# EAGLE design Qgo3 (EAGLE 6.5.0)
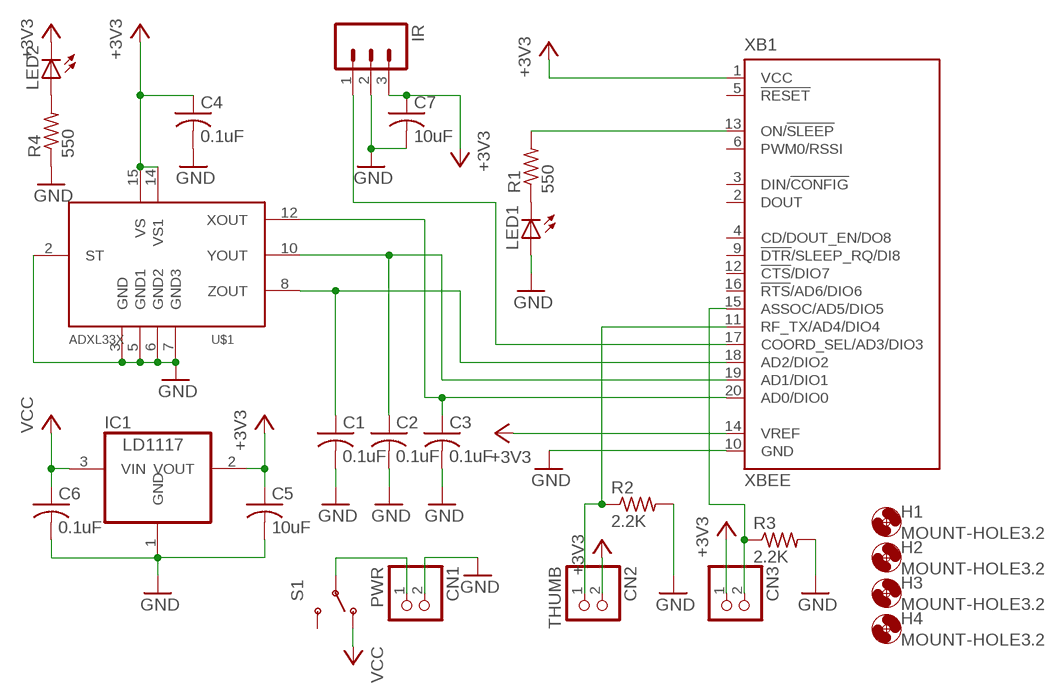
[diagram p0: schematic, sheet 1]

## Parts
C1  0.1uF  C-USC1210  [C1210]
C2  0.1uF  C-USC1210  [C1210]
C3  0.1uF  C-USC1210  [C1210]
C4  0.1uF  C-USC1210  [C1210]
C5  10uF  C-USC1210  [C1210]
C6  0.1uF  C-USC1210  [C1210]
C7  10uF  C-USC1210  [C1210]
CN1  PWR  JST_2PIN-THM-RA  [JST-PH-2-THM-RA]
CN2  THUMB  JST_2PIN-THM-RA  [JST-PH-2-THM-RA]
CN3  JST_2PIN-THM-RA  [JST-PH-2-THM-RA]
H1  MOUNT-HOLE3.2  [3,2]
H2  MOUNT-HOLE3.2  [3,2]
H3  MOUNT-HOLE3.2  [3,2]
H4  MOUNT-HOLE3.2  [3,2]
IC1  LD1117  [SOT223]
IR  M03PTH  [1X03]
LED1  LED5MM  [LED5MM]
LED2  LED5MM  [LED5MM]
R1  550  R-US_0207/7  [0207/7]
R2  2.2K  R-US_0207/7  [0207/7]
R3  2.2K  R-US_0207/7  [0207/7]
R4  550  R-US_0207/7  [0207/7]
S1  SWITCH-SPDTPTH  [SWITCH-SPDT]
U$1  ADXL33X  [16LCSP]
XB1  XBEE  [XBEE]

## Nets
+3V3: C4.1 C5.1 C7.1 CN2.2 CN3.1 IC1.2(VOUT) IR.3 LED2.K(C) U$1.14(VS1) U$1.15(VS) XB1.1(VCC) XB1.14(VREF)
GND: C1.2 C2.2 C3.2 C4.2 C5.2 C6.2 C7.2 CN1.2 IC1.1(GND) IR.2 LED1.A R2.2 R3.2 R4.1 U$1.2(ST) U$1.3(GND) U$1.5(GND1) U$1.6(GND2) U$1.7(GND3) XB1.10(GND)
N$1: C1.1 U$1.8(ZOUT) XB1.18(AD2/DIO2)
N$2: C2.1 U$1.10(YOUT) XB1.19(AD1/DIO1)
N$3: C3.1 U$1.12(XOUT) XB1.20(AD0/DIO0)
N$4: IR.1 XB1.17(COORD_SEL/AD3/DIO3)
N$5: CN1.1 S1.2(P)
N$6: LED1.K(C) R1.1
N$7: R1.2 XB1.13(ON/!SLEEP)
N$8: CN2.1 R2.1 XB1.11(RF_TX/AD4/DIO4)
N$9: LED2.A R4.2
N$11: CN3.2 R3.1 XB1.15(ASSOC/AD5/DIO5)
VCC: C6.1 IC1.3(VIN) S1.1(O)
Unconnected: S1.3(S) XB1.2(DOUT) XB1.3(DIN/!CONFIG) XB1.4(CD/DOUT_EN/DO8) XB1.5(!RESET) XB1.6(PWM0/RSSI) XB1.9(!DTR!/SLEEP_RQ/DI8) XB1.12(!CTS!/DIO7) XB1.16(!RTS!/AD6/DIO6)

## Library data of the parts
C1-C7 = resistor:C-US: CAPACITOR, American symbol
CN1-CN3 = adafruit:JST_2PIN: JST 2-Pin Connectors of various flavors SMT-RA (S2B-PH-SM4) 4UConnector #17311 SMT (B2B-PH-SM4) THM-RA (S2B-PH) THM (B2B-PH)
H1-H4 = holes:MOUNT-HOLE: MOUNTING HOLE with drill center marker
IC1 = myLibrary:LD1117: 800mA and 1A Low Dropout (LDO) Positive Regulator 1.8V, 2.5V, 2.85V, 3.3V, 5V, and Adj; MPN: REG1117; OC_FARNELL: 1097566; OC_NEWARK: 14P6981
IR = SparkFun-Connectors:M03: Header 3 Standard 3-pin 0.1" header. Use with straight break away headers (SKU : PRT-00116), right angle break away headers (PRT-00553), swiss pins (PRT-00743), machine pins (PRT-00117), and female headers (PRT-00115). Molex polarized connector foot print use with SKU : PRT-08232 with associated crimp pins and housings.
LED1 LED2 = adafruit:LED: LED OSRAM: - CHIPLED LG R971, LG N971, LY N971, LG Q971, LY Q971, LO R971, LY R971 LH N974, LH R974 LS Q976, LO Q976, LY Q976 LO Q996 - Hyper CHIPLED LW Q18S LB Q993, LB Q99A, LB R99A - SideLED LS A670, LO A670, LY A670, LG A670, LP A670 LB A673, LV A673, LT A673, LW A673 LH A674 LY A675 LS A676, LA A676, LO A676, LY A676, LW A676 LS A679, LY A679, LG A679 - Hyper Micro SIDELED® LS Y876, LA Y876, LO Y876, LY Y876 LT Y87S - SmartLED LW L88C, LW L88S LB L89C, LB L89S, LG L890 LS L89K, LO L89K, LY L89K LS L896, LA L896, LO L896, LY L896 - TOPLED LS T670, LO T670, LY T670, LG T670, LP T670 LSG T670, LSP T670, LSY T670, LOP T670, LYG T670 LG T671, LOG T671, LSG T671 LB T673, LV T673, LT T673, LW T673 LH T674 LS T676, LA T676, LO T676, LY T676, LB T676, LH T676, LSB T676, LW T676 LB T67C, LV T67C, LT T67C, LS T67K, LO T67K, LY T67K, LW E67C LS E67B, LA E67B, LO E67B, LY E67B, LB E67C, LV E67C, LT E67C LW T67C LS T679, LY T679, LG T679 LS T770, LO T770, LY T770, LG T770, LP T770 LB T773, LV T773, LT T773, LW T773 LH T774 LS E675, LA E675, LY E675, LS T675 LS T776, LA T776, LO T776, LY T776, LB T776 LHGB T686 LT T68C, LB T68C - Hyper Mini TOPLED® LB M676 - Mini TOPLED Santana® LG M470 LS M47K, LO M47K, LY M47K Source: http://www.osram.convergy.de/
R1 R4 = resistor:R-US_: RESISTOR, American symbol
R2 R3 = adafruit:R-US_: RESISTOR, American symbol
S1 = SparkFun-Electromechanical:SWITCH-SPDT: SPDT Switch Simple slide switch, Spark Fun Electronics SKU : COM-00102 DPDT SMT slide switch, AYZ0202, SWCH-08179
U$1 = adafruit:ADXL33X
XB1 = maxstream:XBEE: XBee (TM) /XBee-PRO(TM) OEM RF Modules Source: MaxStream, Inc. xbee_productmanual.pdf; MPN: XBP24-Z7UIT-004; OC_FARNELL: 1751799; OC_NEWARK: 34R5507

## Board
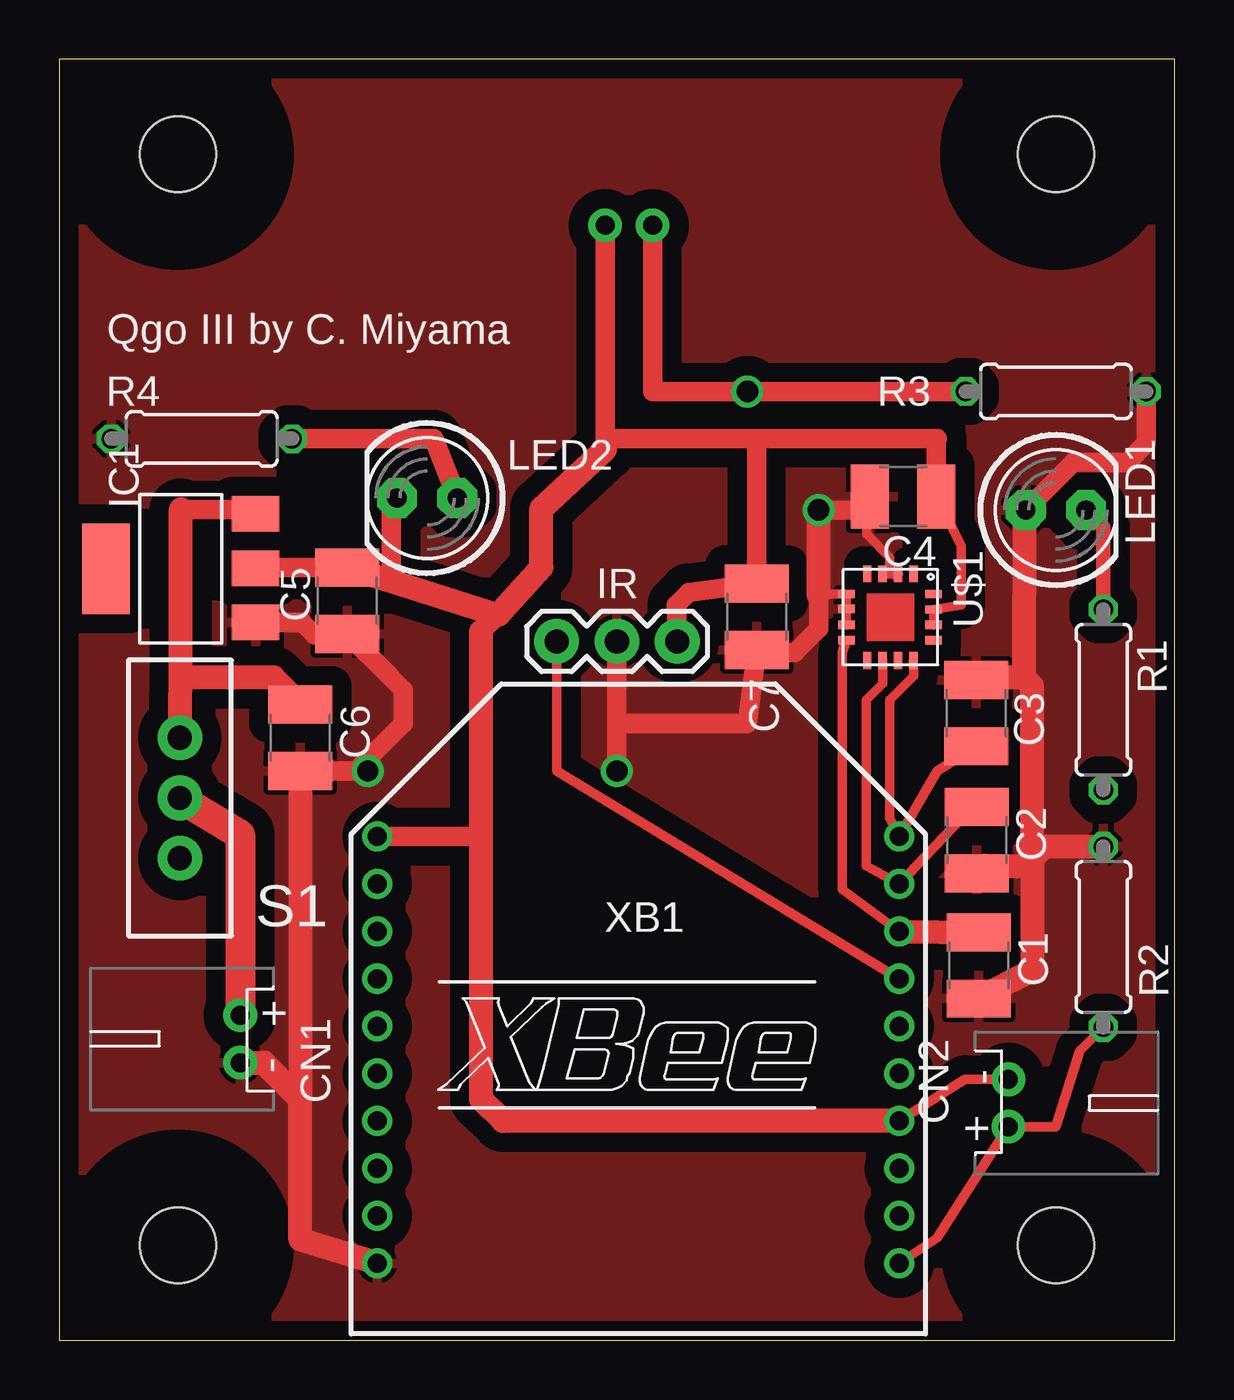
[diagram p1: board, top side]
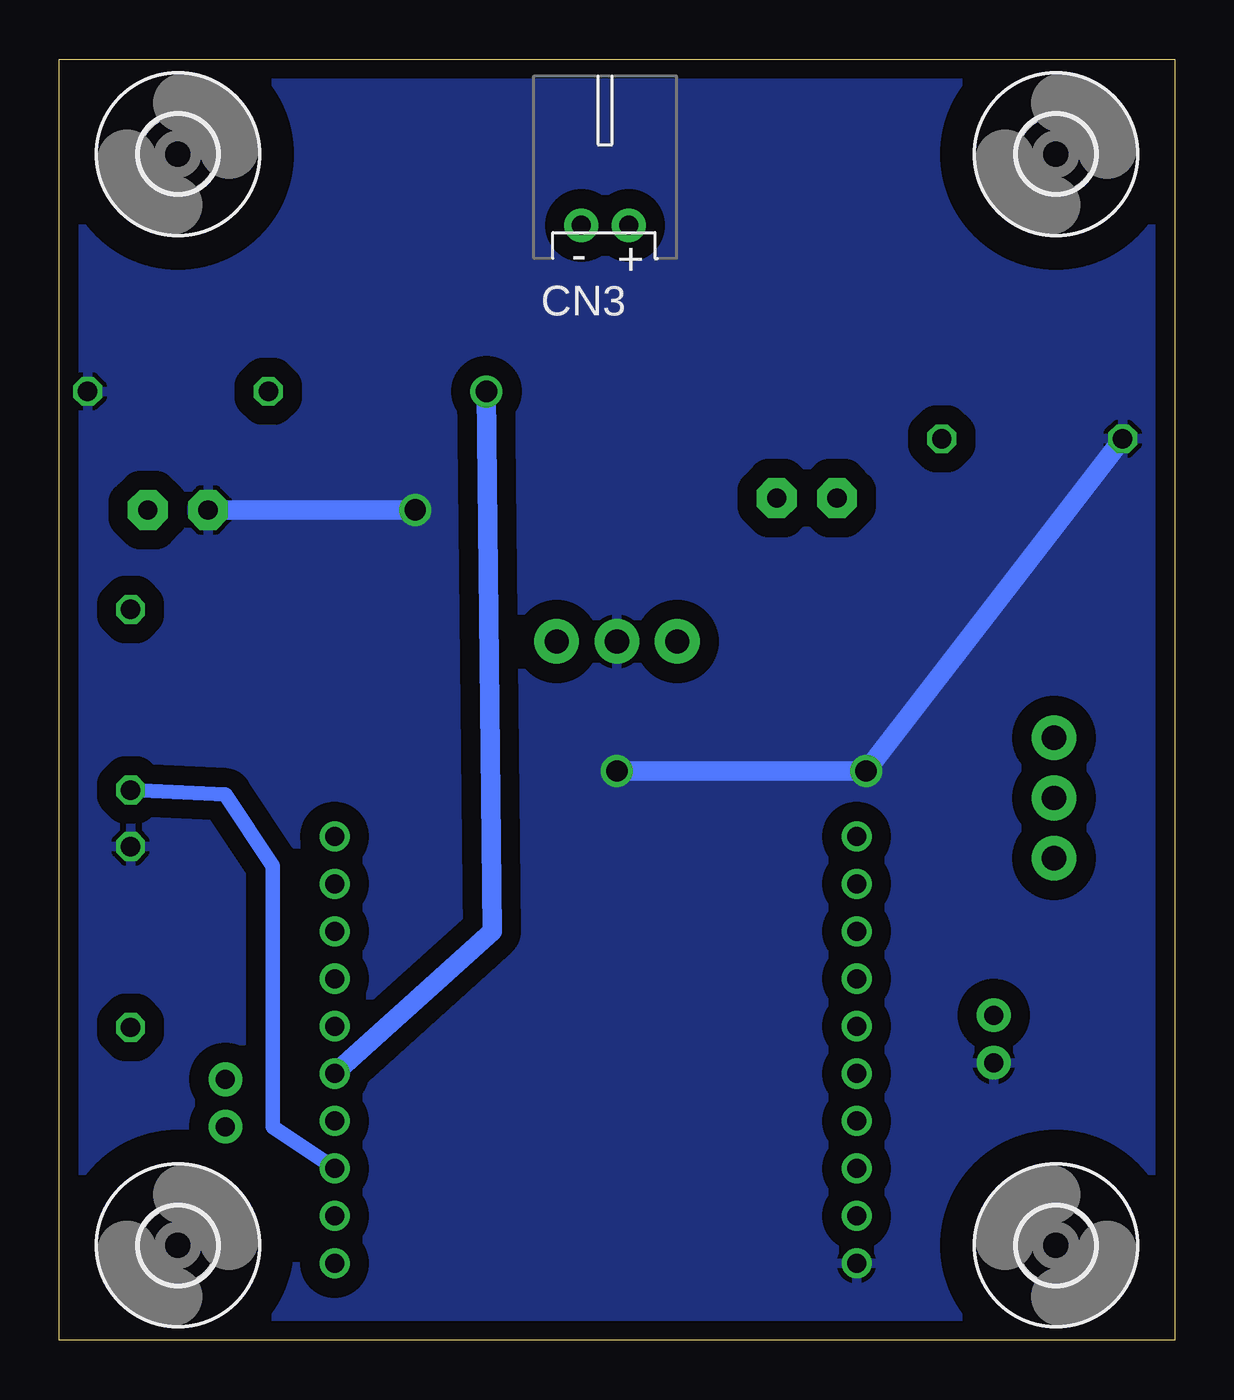
[diagram p2: board, bottom side, seen from below]

Size 47 x 54 mm. Coordinates in mm from the lower left corner, seen from the top.
Outline: 0,0 47,0 47,54 0,54 0,0
Copper layers (1*16): Top 0.018mm / dielectric 1.55mm / Bottom 0.018mm
Design rules "eC_2Layer_PClass6_BaseCopperO18_eCDefault *": minimum track width 0.15mm, minimum drill 0.35mm, track to track 0.15mm, track to pad 0.15mm, pad to pad 0.15mm, via to via 0.15mm, smd to smd 0mil, copper to edge 0.25mm, drill to drill 0.35mm, minimum pad ring 0.175mm, minimum via ring 0.125mm, stop-mask expansion 0mil, vias tented up to drill 0.45mm, thermal gap 0.2mm

### Footprints (pad centres in the part's own frame; a part is rotated, then mirrored left to right if it is on the bottom)
C1210 = smd 1.6 x 2.7: 1 -1.4,0; 2 1.4,0
JST-PH-2-THM-RA = drill 0.8 pad 1.422: 1 1,0; 2 -1,0
3,2 = hole 3.2: 0,0
SOT223 = smd 1.499 x 2.007: 1 -2.261,-3.15; 2 0.025,-3.15; 3 2.311,-3.15 | smd 3.81 x 2.007: 4 0,3.15
1X03 = drill 1.016 pad 1.88: 1 0,0; 2 2.54,0; 3 5.08,0
LED5MM = drill 0.813 pad 1.676 octagon: A -1.27,0; K 1.27,0
0207/7 = drill 0.813 octagon: 1 -3.81,0; 2 3.81,0
SWITCH-SPDT = drill 1.016 pad 1.88: 1 0,2.54; 2 0,0; 3 0,-2.54
16LCSP = smd 0.7 x 0.35: 1 -1.825,0.975; 2 -1.825,0.325; 3 -1.825,-0.325; 4 -1.825,-0.975; 9 1.825,-0.975; 10 1.825,-0.325; 11 1.825,0.325; 12 1.825,0.975 | smd 0.35 x 0.7: 5 -0.975,-1.85; 6 -0.35,-1.85; 7 0.325,-1.85; 8 0.975,-1.85; 13 0.975,1.825; 14 0.325,1.825; 15 -0.325,1.825; 16 -0.975,1.825
XBEE = drill 0.8 pad 1.27: 1 -11,9; 2 -11,7; 3 -11,5; 4 -11,3; 5 -11,1; 6 -11,-1; 7 -11,-3; 8 -11,-5; 9 -11,-7; 10 -11,-9; 11 11,-9; 12 11,-7; 13 11,-5; 14 11,-3; 15 11,-1; 16 11,1; 17 11,3; 18 11,5; 19 11,7; 20 11,9

### Placement (x,y rotation side)
C1  38.74,15.8 270 top
C2  38.66,21.08 270 top
C3  38.64,26.44 90 top
C4  35.56,35.56 180 top
C5  12.14,31.18 270 top
C6  10.16,25.4 270 top
C7  29.4,30.5 270 top
CN1  7.62,12.7 90 top
CN2  40,10 270 top
CN3  24,47 0 bottom
H1  5,50 0 bottom
H2  42,50 0 bottom
H3  42,4 0 bottom
H4  5,4 270 bottom
IC1  5.12,32.52 90 top
IR  20.96,29.46 0 top
LED1  42,35 0 top
LED2  15.5,35.5 180 top
R1  44,27 270 top
R2  44,17 90 top
R3  42,40 0 top
R4  6,38 0 top
S1  5.08,22.86 0 top
U$1  35.02,30.48 270 top
XB1  24.4,12.24 0 top

### Tracks (layer width: path | path; a pad name or v marks a point on that pad's centre or on a via)
+3V3
  Top 0.406: U$1.14 U$1.15 38,31 38,33.5 C4.1 | XB1.14 38.16,11 CN2.2
  Top 0.813: CN3.1 23,38 | 23,38 23,37.56 | 12.46,32.55 12.5,32.5 12.5,32.22 C5.1 8.3,32.58 IC1.2 | C4.1 36.96,37.96 37,38 29.4,38 | 29.4,38 23,38 | 17.78,29.86 18.5,30.58 | XB1.1 17.54,21.24 17.78,21 | 29.4,38 C7.1 26.52,31.52 26,31 IR.3 | LED2.K 14,35.27 14,32
  Top 1.016: C5.1 14,32 18.5,30.58 20.32,32.58 20.32,35.06 23,37.56 | XB1.14 18.7,9.24 17.78,10.16 17.78,21 17.78,29.86
GND  (via drill 0.9)
  Top 0.406: U$1.7 U$1.6 U$1.5 32,31.45 | C4.2 34.16,35.14 34.02,35 34.02,33.98 35,33 35,32.61 U$1.3 U$1.2 | C1.2 38.74,14 | 39,20 39,19.68 C2.2 | 39,28 38.84,27.84 C3.2
  Top 0.813: v32,35 34.02,35 | LED1.A 42.73,37 45,37 45.81,37.81 R3.2 | 11.3,24 12.5,24 12.75,24.25 | 12.75,24.25 14.5,26 14.5,27.42 C5.2 | 13.92,28 C5.2 | IC1.1 10.24,30.26 10.77,29.73 10.82,29.78 C5.2 | v23.5,24 23.5,26 | 23.5,26 IR.2 | v13,24 12.75,24.25 | 23.5,26 29,26 C7.2 29.5,29 31,29 32,30 32,31.45
  Top 1.016: CN1.2 8.62,11.7 10.16,10.16 | XB1.10 10.16,4.24 10.16,10.16 | 10.16,10.16 C6.2 11.3,24 | 32,31.45 v32,35 | LED1.A 40.66,34.93 40.64,27.94 | 41,20.32 41,27.58 40.64,27.94 | 40.64,27.94 38.74,27.94 C3.2 | 39,20 40.68,20 41,20.32 | 41,20.32 41.49,20.81 R2.2 | 41,20.32 41,15.6 C1.2
  Bottom 0.813: v23.5,24 v13,24 R4.1 | v32,35 LED1.A
  pour Top (isolate 0.813): -2.54,55.88 48.26,55.88 48.26,-2.54 -2.54,-2.54
  pour Bottom (isolate 0.813): -2.54,55.88 48.26,55.88 48.26,-2.54 -2.54,-2.54
N$1
  Top 0.406: U$1.8 33,29 33,19 XB1.18
  Top 1.016: XB1.18 C1.1
N$2
  Top 0.406: C2.1 38,22 XB1.19 34,20 34,27 34.7,27.7 U$1.10
N$3
  Top 0.406: C3.1 37,24 XB1.20 35,22 35,27 36,28 U$1.12
N$4
  Top 0.406: IR.1 20.96,24 XB1.17
N$5
  Top 1.27: S1.2 7.62,21.32 CN1.1
N$6
  Top 0.61: LED1.K 44,34.27 R1.1
N$7
  Bottom 0.61: XB1.13 38,9 38,20 40,23 R1.2
N$8
  Top 0.406: R2.1 43,12.19 42,9 CN2.1 37,4.32 XB1.11
N$9
  Top 0.813: R4.2 15.77,38 LED2.A
N$11  (via drill 0.9)
  Top 0.813: CN3.2 25,40 v29,40 R3.1
  Bottom 0.813: XB1.15 28.76,17.24 v29,40
VCC
  Top 0.813: 5.12,35.02 8.08,35.02 IC1.3
  Top 1.016: S1.1 5.12,27.94 | C6.1 9.02,27.94 5.12,27.94 | 5.12,27.94 5.12,35.02

### Text on the board
tNames: Qgo III by C. Miyama